# Altium schematic sheet Aptomat_buttons_and_leds.SchDoc: APTOMAT - Buttons and LEDs
size A4; Revision: 1.1.1; SheetNumber: 3; SheetTotal: 5; DrawnBy: KJP; ProjectNumber: 4397; PCBRevision: 0071KJP; DocumentSize: A4; PCAName: PCA10040; PCBNumber: 400150; ProjectName: Quark
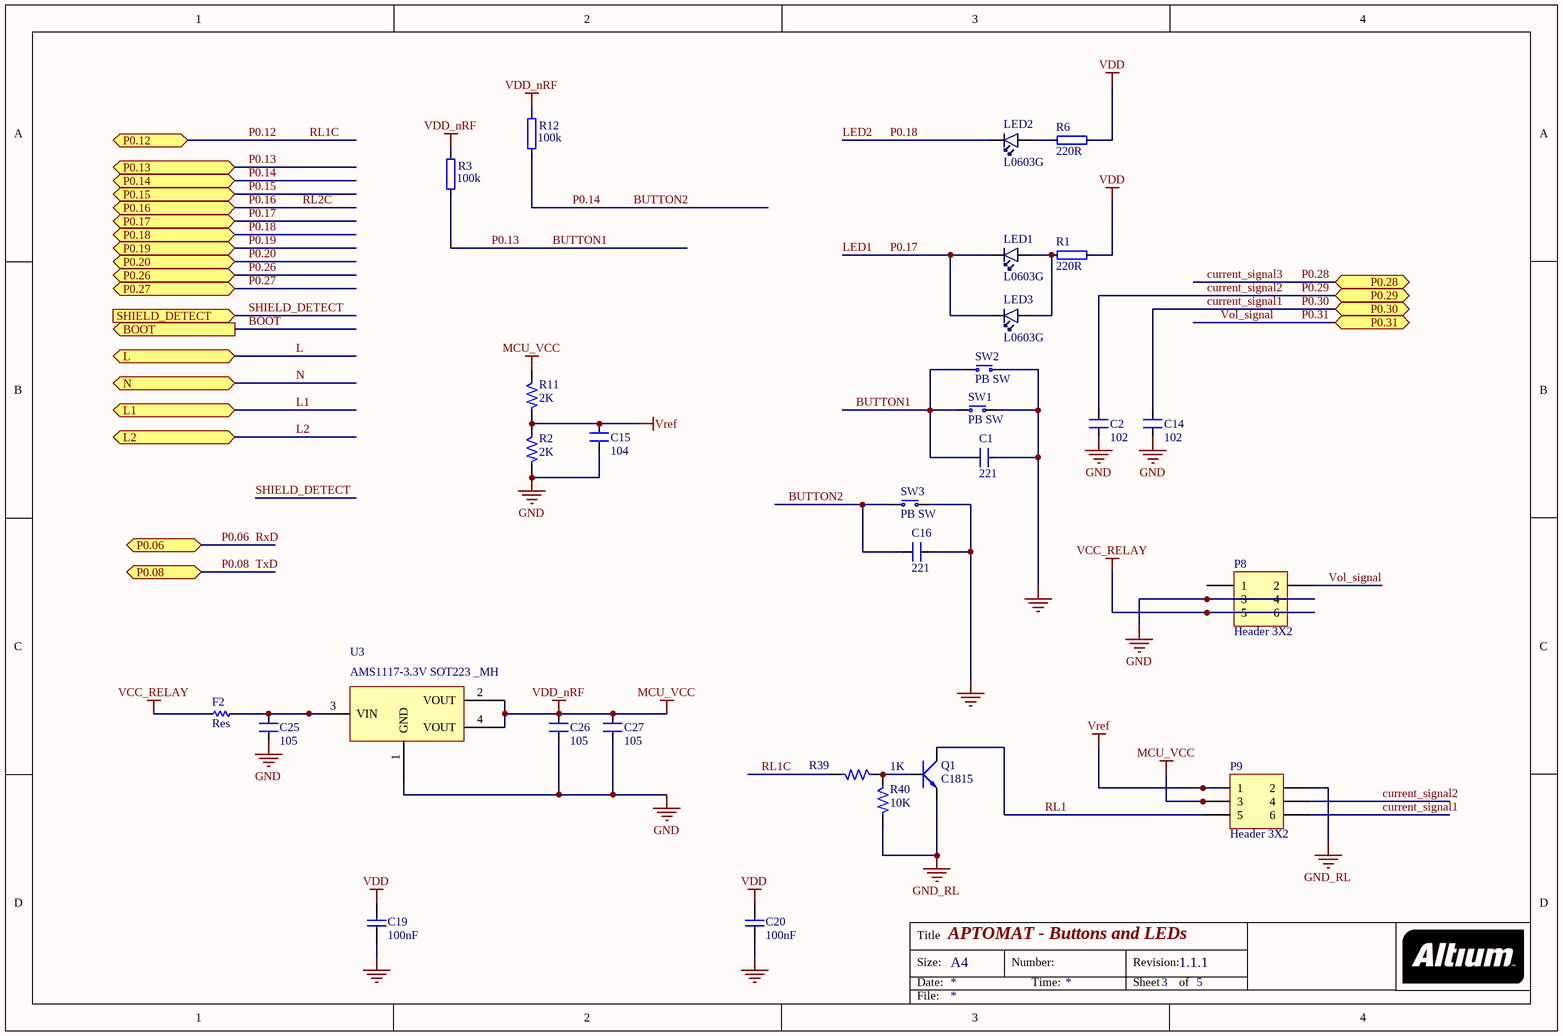
[diagram p0: Aptomat_buttons_and_leds.SchDoc]

## Parts
C1  221  [0805_HV]
C2  102  [0805_HV]
C14  102  [0805_HV]
C15  104  [0805_HV]
C16  221  [0805_HV]
C19  100nF  [CAPC1005X04L]
C20  100nF  [CAPC1005X04L]
C25  105  [0805_HV]
C26  105  [0805_HV]
C27  105  [0805_HV]
F2  Res  [1206]
LED1  L0603G  [LED_0603N]
LED2  L0603G  [LED_0603N]
LED3  L0603G  [LED_0603N]
P8  Header 3X2  [HDR2X3]
P9  Header 3X2  [HDR2X3]
Q1  C1815  [SOT23B]
R1  220R  [0603]
R2  2K  [0805_HV]
R3  100k  [0603]
R6  220R  [0603]
R11  2K  [0805_HV]
R12  100k  [0603]
R39  1K  [0805_HV]
R40  10K  [0805_HV]
SW1  PB SW  [TL3330AF260QG]
SW2  PB SW  [TL3330AF260QG]
SW3  PB SW  [TL3330AF260QG]
U3  AMS1117-3.3V SOT223 _MH  [SOT223]

## Ports
BOOT (out), L1 (bidir), L2 (bidir), L (bidir), N (bidir), P0.06 (bidir), P0.08 (bidir), P0.12 (bidir), P0.13 (bidir), P0.14 (bidir), P0.15 (bidir), P0.16 (bidir), P0.17 (bidir), P0.18 (bidir), P0.19 (bidir), P0.20 (bidir), P0.26 (bidir), P0.27 (bidir), P0.28 (bidir), P0.29 (bidir), P0.30 (bidir), P0.31 (bidir), SHIELD_DETECT (in)

## Nets
GND: C1.1 C2.1 C14.1 C15.1 C16.1 C19.1 C20.1 C25.1 C26.1 C27.1 P8.3 P8.4 R2.2 SW1.1(N.O) SW2.1(N.O) SW3.1(N.O) U3.1(GND)
GND_RL: P9.2 Q1.3(E) R40.2
MCU_VCC: C26.2 C27.2 P9.3 R3.2 R11.1 R12.2 U3.2(VOUT) U3.4(VOUT)  [also labelled VDD_nRF]
VCC_RELAY: F2.2 P8.5 P8.6
VDD: C19.2 C20.2 R1.2 R6.2
Vref: C15.2 P9.1 R2.1 R11.2
BOOT: port BOOT
BUTTON1: C1.2 R3.1 SW1.2(COM) SW2.2(COM) ; port P0.13  [also labelled P0.13]
BUTTON2: C16.2 R12.1 SW3.2(COM) ; port P0.14  [also labelled P0.14]
current_signal1: C14.2 P9.6 ; port P0.30  [also labelled P0.30]
current_signal2: C2.2 P9.4 ; port P0.29  [also labelled P0.29]
current_signal3: port P0.28  [also labelled P0.28]
L: port L
L1: port L1
L2: port L2
LED1: LED1.1(C) LED3.1(C) ; port P0.17  [also labelled P0.17]
LED2: LED2.1(C) ; port P0.18  [also labelled P0.18]
N: port N
P0.06: port P0.06  [also labelled RxD]
P0.08: port P0.08  [also labelled TxD]
P0.12: R39.2 ; port P0.12  [also labelled RL1C]
P0.15: port P0.15
P0.16: port P0.16  [also labelled RL2C]
P0.19: port P0.19
P0.20: port P0.20
P0.26: port P0.26
P0.27: port P0.27
P0.31: P8.2 ; port P0.31  [also labelled Vol_signal]
RL1: P9.5 Q1.2(C)
SHIELD_DETECT: port SHIELD_DETECT
NetC25_2: C25.2 F2.1 U3.3(VIN)
NetLED1_2: LED1.2(A) LED3.2(A) R1.1
NetLED2_2: LED2.2(A) R6.1
NetQ1_1: Q1.1(B) R39.1 R40.1

Not connected (* = marked no-connect by the designer): P8 1

## Notes on the sheet
- Title
- Size:
- Date:
- A4
- Number:
- Time:
- Revision:
- Sheet
- of
- File:

## Library data of the parts
C1 C2 C14-C16 C25-C27 = CM: Cap SMD; Value: 103
C19 C20 = C0402-100n: Capacitor, X7R, ±10%; Note: 16V; Artikkelnr Noca: 20039200; Artikkelnr Simpro: N.A.; Part Number: C0402-100n; Manufacturer: *; Manufacturer Part Number: *; Datasheet: *; Footprint Doc: 0402; LatestRevisionDate: 2009-11-23; Pin Count: 2; Publisher: Nordic Semiconductor; Published: 2009-05-08; Value: 100nF; Supplier: *; Supplier part number: *; 2nd source Supplier: *; 2nd source part number: *
F2 = Res-SMD: Resistor; Manufacturer: Generic Components; Class: Passive; Published: 08/06/2000; Publisher: Altium Hobart Technology Centre
LED1-LED3 = LG L29K Smartled Green: LED SMARTLED GREEN 570NM 0603; Manufacturer: Multicomp; Manufacturer Part Number: LG L29K-G2J1-24-Z; Note: 2,24..5.6 mcd, Vfmin=1.7V; Artikkelnr Noca: N.A.; Part Number: LG L29K Smartled Green; Datasheet: http://www.osram-os.com/Graphics/XPic2/00077107_0.pdf; Footprint Doc: 0603; LatestRevisionDate: 2014-10-28; Pin Count: 2; Publisher: Nordic Semiconductor; Published: 2014-10-28; Value: L0603G; Supplier: Digi-Key; Supplier part number: 475-2709-1-ND; 2nd source Supplier: *; 2nd source part number: *; Artikkelnr Simpro: N.A.
P8 P9 = Header 3X2: Header, 3-Pin, Dual row; LatestRevisionDate: 17-Jul-2002; LatestRevisionNote: Re-released for DXP Platform.; Publisher: Altium Limited
Q1 = C1815: NPN 600mW, ECB; Value: C1815
R1 R6 = R0402-220: Resistor, ±1%, 0.063W; Note: Chip Res 1%; Artikkelnr Noca: 27049057; Artikkelnr Simpro: N.A.; Part Number: R0402-220; Manufacturer: *; Manufacturer Part Number: *; Datasheet: *; LatestRevisionDate: 2009-11-23; Pin Count: 2; Publisher: Nordic Semiconductor; Published: 2009-05-08; Value: 220R; Supplier: Farnell; Supplier part number: 173-8841; 2nd source Supplier: *; 2nd source part number: *; Footprint Doc: 0402
R2 R11 R39 R40 = R: Resistor 1/4W; Value: R1/4W - 1K
R3 R12 = R0402-100k: Resistor, ±1%, 0.063W; Note: Chip Res 1%; Artikkelnr Noca: 27049121; Artikkelnr Simpro: N.A.; Part Number: R0402-100k; Manufacturer: *; Manufacturer Part Number: *; Datasheet: *; Footprint Doc: 0402; LatestRevisionDate: 2009-11-23; Pin Count: 2; Publisher: Nordic Semiconductor; Published: 2009-05-08; Value: 100k; Supplier: Farnell; Supplier part number: 173-8877; 2nd source Supplier: *; 2nd source part number: *
SW1-SW3 = Switch-PB-6.2x6.3mm-SMD: Tactile Switch, SPNO, SMD, 160gf, 6.2x6.3x2.5mm; Manufacturer: Dailywell; Manufacturer Part Number: TS604VM1-025BR-R; 2nd source part number: 688-SKHUALE010; Artikkelnr Noca: 50019106; Artikkelnr Simpro: N.A.; Part Number: Switch-PB-6.2x6.3mm-SMD; Datasheet: \\hizz\pro\app9717\Datasheet\switches\Daliywell\TS604VM1-025BR-R.pdf; Footprint Doc: Switch-PB-6.2x6.3mm-SMD; LatestRevisionDate: 2016-04-21; Pin Count: 4; Publisher: Nordic Semiconductor; Published: 2010-02-01; Value: PB SW; Note: *; Supplier: Cabcon; Supplier part number: TS604VM1-025BR-R; 2nd source Supplier: Mouser